# Altium schematic sheet Cell2_Balancing.SchDoc
size A; DocumentNumber: 5; SheetNumber: 5; SheetTotal: 7
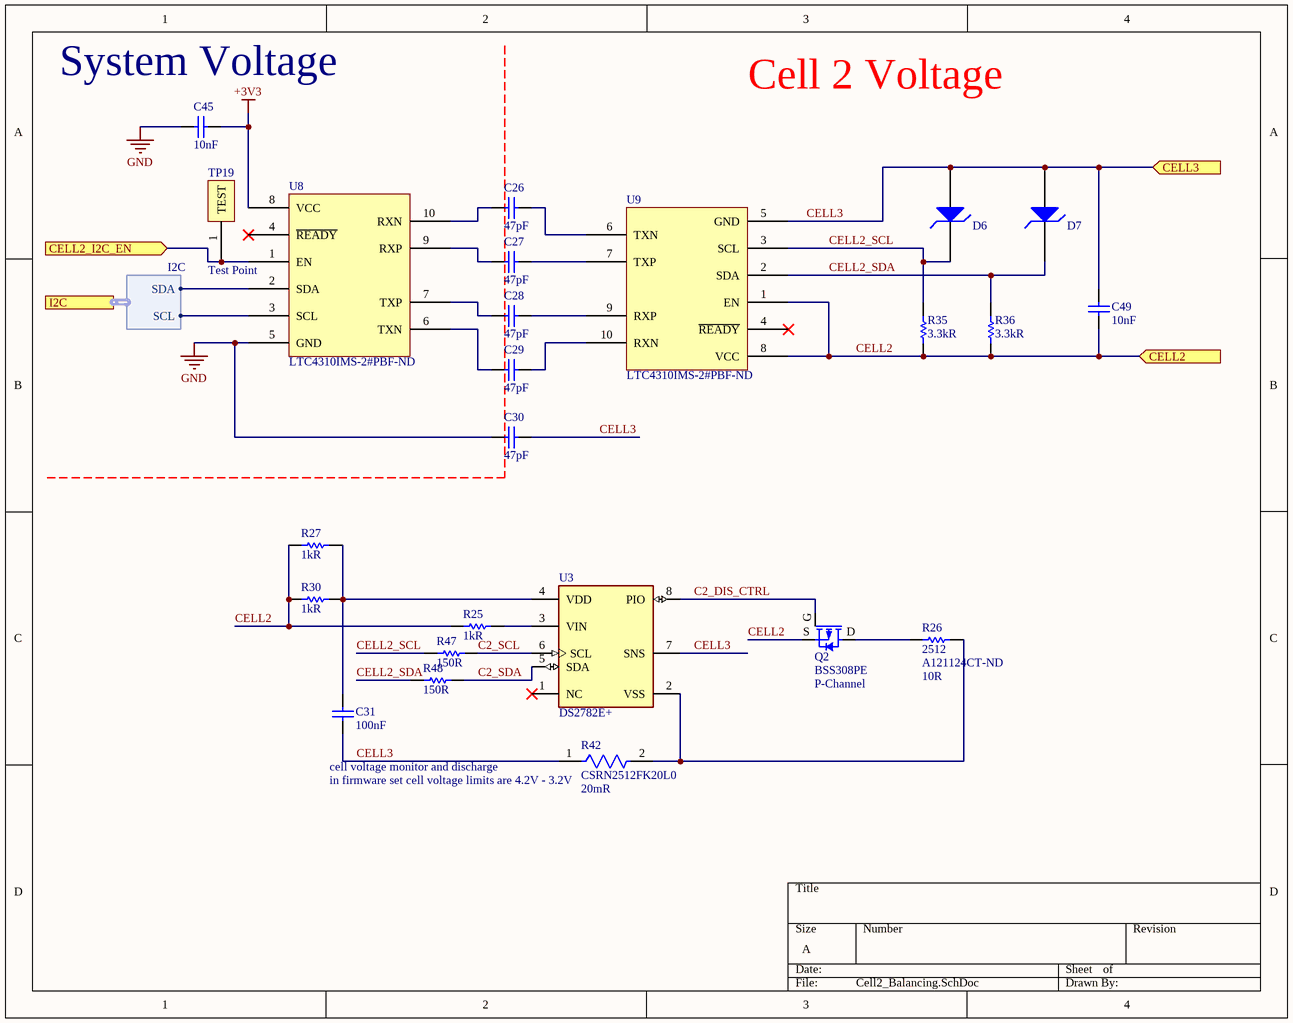
[diagram p0: Cell2_Balancing.SchDoc]

## Parts
C26  Capacitance: 47pF  [CAPC1608X90X35ML15T15]  (hidden comment: 06031A470FAT2A)
C27  Capacitance: 47pF  [CAPC1608X90X35ML15T15]  (hidden comment: 06031A470FAT2A)
C28  Capacitance: 47pF  [CAPC1608X90X35ML15T15]  (hidden comment: 06031A470FAT2A)
C29  Capacitance: 47pF  [CAPC1608X90X35ML15T15]  (hidden comment: 06031A470FAT2A)
C30  Capacitance: 47pF  [CAPC1608X90X35ML15T15]  (hidden comment: 06031A470FAT2A)
C31  Capacitance: 100nF  [C0402]  (hidden comment: Capacitor 0402)
C45  Capacitance: 10nF  [C0402]  (hidden comment: Capacitor 0402)
C49  Capacitance: 10nF  [C0402]  (hidden comment: Capacitor 0402)
D6  BZT52C4V7LP-7  [bzt52c4v7lp-7]  (value not drawn)
D7  BZT52C4V7LP-7  [bzt52c4v7lp-7]  (value not drawn)
Q2  BSS308PE  FET Type: P-Channel  [BSS308PE]
R25  Resistance: 1kR  [RES0402]  (hidden comment: Resistor 0402)
R26  Package / Case: 2512  Supplier Part Number 1: A121124CT-ND  Resistance: 10R  [RES2512]  (hidden comment: Resistor 2512)
R27  Resistance: 1kR  [RES0402]  (hidden comment: Resistor 0402)
R30  Resistance: 1kR  [RES0402]  (hidden comment: Resistor 0402)
R35  Resistance: 3.3kR  [RES0402]  (hidden comment: Resistor 0402)
R36  Resistance: 3.3kR  [RES0402]  (hidden comment: Resistor 0402)
R42  CSRN2512FK20L0  Resistance: 20mR  [FP-CSRN2512-IPC_C]
R47  Resistance: 150R  [RES0402]  (hidden comment: Resistor 0402)
R48  Resistance: 150R  [RES0402]  (hidden comment: Resistor 0402)
TP19  Test Point  [TEST POINT]
U3  DS2782E+  [FP-H8-2-MFG]
U8  LTC4310IMS-2#PBF-ND  [MSOP-10_MS_LIT]
U9  LTC4310IMS-2#PBF-ND  [MSOP-10_MS_LIT]

## Ports
CELL2 (in), CELL2_I2C_EN (in), CELL3 (in), I2C (harness I2C)

## Harnesses
I2C: SCL, SDA

## Nets
+3V3: C45.1 U8.8(VCC)
GND: C30.1 C45.2 U8.5(GND)
C2_DIS_CTRL: Q2.G U3.8(PIO)
C2_SCL: R47.1 U3.6(SCL)
C2_SDA: R48.1 U3.5(SDA)
CELL2: C49.2 Q2.S R25.1 R27.1 R30.1 R35.1 R36.1 U9.1(EN) U9.8(VCC) ; port CELL2
CELL2_I2C_EN: TP19.1(TEST) U8.1(EN) ; port CELL2_I2C_EN
CELL2_SCL: D6.1(K) R35.2 R47.2 U9.3(SCL)
CELL2_SDA: D7.1(K) R36.2 R48.2 U9.2(SDA)
CELL3: C30.2 C31.1 C49.1 D6.2(A) D7.2(A) R42.1 U3.7(SNS) U9.5(GND) ; port CELL3
NetC26_1: C26.1 U8.10(RXN)
NetC26_2: C26.2 U9.6(TXN)
NetC27_1: C27.1 U8.9(RXP)
NetC27_2: C27.2 U9.7(TXP)
NetC28_1: C28.1 U8.7(TXP)
NetC28_2: C28.2 U9.9(RXP)
NetC29_1: C29.1 U8.6(TXN)
NetC29_2: C29.2 U9.10(RXN)
NetC31_2: C31.2 R27.2 R30.2 U3.4(VDD)
NetQ2_D: Q2.D R26.1
NetR25_2: R25.2 U3.3(VIN)
NetR26_2: R26.2 R42.2 U3.2(VSS)
NetU8_2: U8.2(SDA) ; port I2C.SDA
NetU8_3: U8.3(SCL) ; port I2C.SCL

Not connected (* = marked no-connect by the designer): U3 1(NC)*; U8 4(~{READY})*; U9 4(~{READY})*

## Notes on the sheet
- (near C45) System Voltage
- Cell 2 Voltage
- cell voltage monitor and discharge
- (near R42) in firmware set cell voltage limits are 4.2V - 3.2V

## Library data of the parts
C26-C30 = CMP-2006-04042-1: Manufacturer: AVX Interconnect / Elco; Voltage Rating: 100V; Part Number: 06031A470FAT2A
C31 = Capacitor 0402: CAP CER 0.1UF 25V X5R 0402 / High Value Multilayer Ceramic Capacitors (High dielectric type); Manufacturer: Taiyo Yuden; Manufacturer Part Number: TMK105BJ104KV-F; Tolerance: 10%; Package / Case: 0402; Supplier 1: Digi-Key; Supplier Part Number 1: 587-1456-1-ND; RoHS: Yes; Category: Ceramic Capacitors; Stock 1: 2308231; Pricing 1: 1=0.10000, 10=0.04200, 50=0.02280, 100=0.01860, 500=0.01328, 1000=0.01044, 2500=0.00949, 5000=0.00873 (USD); Mount: Surface Mount; Case/Package: 0402; Number of Pins: 2; Case Code (Imperial): 0402; Case Code (Metric): 1005; Weight: 2.3E-05oz; Min Operating Temperature: -55°C; Max Operating Temperature: 85°C; Packaging: Tape and Reel; Dielectric: X5R; Voltage Rating (DC): 25V; Voltage Rating: 25V; Package Quantity: 1; Termination: SMD/SMT; Resistor Type: Ceramic; Voltage: 25V; Series: M; Construction: Flat; Length: 1mm; Width: 0.5mm; Height: 0.5mm; Depth: 0.5mm; Thickness: 0.022inch; REACH SVHC: No SVHC; Lead Free: Lead Free; Halogen Free: Halogen Free; RoHS Compliant: Yes; ComponentLink1URL: https://datasheet.ciiva.com/131/tmk105bj104kv-f-ss-131420.pdf?src-supplier=Digi-Key; ComponentLink1Description: https://datasheet.ciiva.com/131/tmk105bj104kv-f-ss-131420.pdf?src-supplier=Digi-Key; ComponentLink2URL: https://datasheet.ciiva.com/15922/28tmk105bj104kv-f-15922315.pdf?src-supplier=Onlinecomponents.com; ComponentLink2Description: https://datasheet.ciiva.com/15922/28tmk105bj104kv-f-15922315.pdf?src-supplier=Onlinecomponents.com; ComponentLink3URL: https://datasheet.ciiva.com/30051/25tmk105bj104kv-f-30051094.pdf?src-supplier=Onlinecomponents.com; ComponentLink3Description: https://datasheet.ciiva.com/30051/25tmk105bj104kv-f-30051094.pdf?src-supplier=Onlinecomponents.com; ComponentLink4URL: https://datasheet.ciiva.com/22768/1693457-22768649.pdf?src-supplier=Farnell; ComponentLink4Description: https://datasheet.ciiva.com/22768/1693457-22768649.pdf?src-supplier=Farnell
C45 C49 = Capacitor 0402: Cap Ceramic 0.01uF 25V X7R 10% Pad SMD 0402 125C T/R; Manufacturer: Samsung; Manufacturer Part Number: CL05B103KA5NNNC; Package / Case: 0402; Supplier 1: Digi-Key; Supplier Part Number 1: 1276-1057-2-ND; RoHS: Yes; Category: Ceramic Capacitors; Stock 1: 889741; Pricing 1: 10000=0.00314, 20000=0.00299 (USD); Mount: Surface Mount; Case/Package: 0402; Case Code (Metric): 1005; Case Code (Imperial): 0402; Contact Plating: Tin; Min Operating Temperature: -55°C; Max Operating Temperature: 125°C; Tolerance: 10%; Dielectric: X7R; Packaging: Tape and Reel; Package Quantity: 1; Voltage Rating: 25V; Series: CL; Construction: Flat; Length: 1mm; Width: 0.02inch; Height: 0.5mm; Thickness: 0.022inch; Depth: 0.5mm; Radiation Hardening: No; RoHS Compliant: Yes; ComponentLink1URL: https://datasheet.ciiva.com/15195/getdatasheetpartid-358612-15195635.pdf?src-supplier=Verical; ComponentLink1Description: https://datasheet.ciiva.com/15195/getdatasheetpartid-358612-15195635.pdf?src-supplier=Verical; ComponentLink2URL: https://datasheet.ciiva.com/16740/cl05b104kq5nnnc-16740683.pdf?src-supplier=Future+Electronics; ComponentLink2Description: https://datasheet.ciiva.com/16740/cl05b104kq5nnnc-16740683.pdf?src-supplier=Future+Electronics
D6 D7 = BZT52C4V7LP-7: BZT52C4V7LP Series 4.7 V 10 mA Surface Mount Zener Diode - DFN1006-2; Manufacturer: Diodes; Max Power Dissipation: 250mW; Max Reverse Leakage Current: 3uA; Zener Voltage: 4.7V; Element Configuration: Single; Tolerance: 6%; Impedance: 80R; Voltage Tolerance: 6.38%; Test Current: 5mA; Forward Voltage: 900mV; ESD Protection: No; Supplier 1: Digi-Key; Supplier Part Number 1: BZT52C4V7LPDICT-ND; Manufacturer Part Number: BZT52C4V7LP-7; RoHS: Yes; Category: Zener Diodes; Stock 1: 13216; Pricing 1: 1=0.50000, 10=0.37000, 100=0.20930, 500=0.13860, 1000=0.10626 (USD); Mount: Surface Mount; Case/Package: DFN; Number of Pins: 2; Weight: 3.5E-05oz; Contact Plating: Gold; Min Operating Temperature: -65°C; Max Operating Temperature: 150°C; Packaging: Tape and Reel; Package Quantity: 3000; Power Dissipation: 250mW; Termination: SMD/SMT; Zener Current: 3uA; Max Reverse Current: 3uA; Power Rating: 250mW; Series: -; Length: 1mm; Width: 0.6mm; Height: 0.5mm; REACH SVHC: No SVHC; Lead Free: Lead Free; RoHS Compliant: Yes; ComponentLink1URL: https://datasheet.ciiva.com/4734/ds30506-89295-4734027.pdf?src-supplier=Mouser; ComponentLink1Description: https://datasheet.ciiva.com/4734/ds30506-89295-4734027.pdf?src-supplier=Mouser; ComponentLink2URL: https://datasheet.ciiva.com/10639/ds30506-10639820.pdf?src-supplier=Avnet; ComponentLink2Description: https://datasheet.ciiva.com/10639/ds30506-10639820.pdf?src-supplier=Avnet
Q2 = BSS308PE: MOSFET P-CH 30V 2A SOT23; Current - Continuous Drain (Id) @ 25°C: 2A (Ta); Drive Voltage (Max Rds On, Min Rds On): 4.5V, 10V; Vgs(th) (Max) @ Id: 2V @ 11µA; Gate Charge (Qg) (Max) @ Vgs: 5nC @ 10V; Input Capacitance (Ciss) (Max) @ Vds: 500pF @ 15V; Vgs (Max): ±20V; Power Dissipation (Max): 500mW (Ta); Rds On (Max) @ Id, Vgs: 80 mOhm @ 2A, 10V; Supplier 1: Digi-Key; Supplier Part Number 1: BSS308PEH6327XTSA1CT-ND; Technology: MOSFET; Drain to Source Voltage (Vdss): 30V; Operating Temperature: -55°C ~ 150°C (TJ); Supplier Device Package: PG-SOT23-3
R25 R27 R30 = Resistor 0402: Res Thick Film 0402 1K Ohm 1% 0.063W(1/16W) ±100ppm/C Pad SMD Automotive T/R; Manufacturer: Stackpole Electronics; Manufacturer Part Number: RMCF0402FT1K00; Power Rating: 63mW; Temperature Coefficient: 100ppm/°C; Package / Case: 0402; Supplier 1: Digi-Key; Supplier Part Number 1: RMCF0402FT1K00CT-ND; RoHS: Yes; Category: Chip SMD Resistors; Stock 1: 10972117; Pricing 1: 1=0.10000, 10=0.01500, 100=0.00610, 1000=0.00274, 2500=0.00238, 5000=0.00197 (USD); Mount: Surface Mount; Case/Package: 0402; Case Code (Metric): 1005; Case Code (Imperial): 0402; Contact Plating: Tin,Matte; Size Code: 0402; Min Operating Temperature: -55°C; Max Operating Temperature: 155°C; Tolerance: 1%; Packaging: Tape and Reel; Resistor Type: Thick Film; Number of Terminations: 2; Max Power Dissipation: 63mW; Features: Automotive AEC-Q200; Series: RMCF; Construction: Rectangular; Length: 1mm; Width: 0.02inch; Height: 0.016inch; Depth: 0.5mm; Radiation Hardening: No; Military Standard: Not; Lead Free: Lead Free; RoHS Compliant: Yes; ComponentLink1URL: https://datasheet.ciiva.com/24336/sei-rmcp-24336266.pdf?src-supplier=Onlinecomponents.com; ComponentLink1Description: https://datasheet.ciiva.com/24336/sei-rmcp-24336266.pdf?src-supplier=Onlinecomponents.com; ComponentLink2URL: https://datasheet.ciiva.com/15193/getdatasheetpartid-365385-15193418.pdf?src-supplier=Verical; ComponentLink2Description: https://datasheet.ciiva.com/15193/getdatasheetpartid-365385-15193418.pdf?src-supplier=Verical
R26 = Resistor 2512: CGS - TE CONNECTIVITY - 352210RJT - SMD Chip Resistor, 2512 [6432 Metric], 10 ohm, 3522 Series, 250 V, Thick Film, 3 W; Manufacturer: TE Connectivity CGS; Manufacturer Part Number: 1-2176230-4; Power Rating: 3W; Voltage Rating: 250V; Tolerance: 5%; Number of Resistors: 1; Temperature Coefficient: 200ppm/°C; Supplier 1: Digi-Key; RoHS: Yes; Category: Chip SMD Resistors; Stock 1: 3022; Pricing 1: 1=0.74000, 10=0.62000, 100=0.41620, 1000=0.24350 (USD); Mount: Surface Mount; Case/Package: 2512; Case Code (Metric): 6432; Case Code (Imperial): 2512; Min Operating Temperature: -55°C; Max Operating Temperature: 105°C; Termination: Solder; Packaging: Tape and Reel; Resistor Type: Thick Film,Power resistor; Voltage Rating (DC): 250V; Number of Terminations: 2; Length: 6.35mm; Height: 1.1mm; Depth: 3.2mm; RoHS Compliant: Yes; REACH SVHC: Unknown; ComponentLink1URL: http://www.farnell.com/datasheets/2007092.pdf?src-supplier=Farnell; ComponentLink1Description: http://www.farnell.com/datasheets/2007092.pdf?src-supplier=Farnell; ComponentLink2URL: http://uk.rs-online.com/webdocs/142d/0900766b8142d0f1.pdf?src-supplier=RSComponents; ComponentLink2Description: http://uk.rs-online.com/webdocs/142d/0900766b8142d0f1.pdf?src-supplier=RSComponents; ComponentLink3URL: http://www.te.com/commerce/DocumentDelivery/DDEController?Action=srchrtrv&DocNm=9-1773463-7&DocType=DS&DocLang=English&src-supplier=Digi-Key; ComponentLink3Description: http://www.te.com/commerce/DocumentDelivery/DDEController?Action=srchrtrv&DocNm=9-1773463-7&DocType=DS&DocLang=English&src-supplier=Digi-Key; ComponentLink4URL: https://www.te.com/commerce/DocumentDelivery/DDEController?Action=srchrtrv&DocNm=9-1773463-7&DocType=DS&DocLang=English&src-supplier=Digi-Key; ComponentLink4Description: https://www.te.com/commerce/DocumentDelivery/DDEController?Action=srchrtrv&DocNm=9-1773463-7&DocType=DS&DocLang=English&src-supplier=Digi-Key; ComponentLink5URL: http://www.farnell.com/datasheets/2007092.pdf?src-supplier=Element14; ComponentLink5Description: http://www.farnell.com/datasheets/2007092.pdf?src-supplier=Element14; ComponentLink6URL: http://www.farnell.com/datasheets/2007092.pdf?src-supplier=Newark; ComponentLink6Description: http://www.farnell.com/datasheets/2007092.pdf?src-supplier=Newark
R35 R36 = Resistor 0402: Res Thin Film 0402 3.3K Ohm 1% 1/16W ±50ppm/°C Molded SMD SMD Paper T/R; Manufacturer: Yageo; Manufacturer Part Number: RT0402FRE073K3L; Power Rating: 62.5mW; Voltage Rating: 50V; Max Power Dissipation: 63mW; Package / Case: 0402; Supplier 1: Digi-Key; Supplier Part Number 1: 13-RT0402FRE073K3LCT-ND; RoHS: Yes; Category: Chip SMD Resistors; Stock 1: 19890; Pricing 1: 1=0.10000, 10=0.07300, 100=0.02970, 1000=0.01336, 2500=0.01159, 5000=0.00958 (USD); Case/Package: 0402; Contact Plating: Tin,Matte; Case Code (Imperial): 0402; Case Code (Metric): 1005; Weight: 2.3E-05oz; Min Operating Temperature: -55°C; Max Operating Temperature: 125°C; Tolerance: 1%; Resistor Type: Thin Film; Temperature Coefficient: 50ppm/°C; Packaging: Tape and Reel; Termination: SMD/SMT; Voltage Rating (DC): 50V; Series: RT; Number of Terminations: 2; Construction: Rectangular; Length: 1mm; Width: 0.5mm; Height: 0.3mm; Depth: 0.5mm; Radiation Hardening: No; Military Standard: Not; Lead Free: Lead Free; RoHS Compliant: Yes; ComponentLink1URL: https://datasheet.ciiva.com/8893/pyu-rt-1-to-0-05-rohs-l-4-8893834.pdf?src-supplier=Avnet; ComponentLink1Description: https://datasheet.ciiva.com/8893/pyu-rt-1-to-0-05-rohs-l-4-8893834.pdf?src-supplier=Avnet; ComponentLink2URL: https://datasheet.ciiva.com/12810/pyu-rt-1-to-0-05-rohs-l-4-12810011.pdf?src-supplier=Mouser; ComponentLink2Description: https://datasheet.ciiva.com/12810/pyu-rt-1-to-0-05-rohs-l-4-12810011.pdf?src-supplier=Mouser
R42 = CMP-26527-002510-1: Res Thick Film 2512 20mΩ 1% 2W ±200ppm/°C Molded SMD Plastic T/R; Case/Package: 2512; Case Code (Metric): 6432; Length: 0.25inch; Temperature Coefficient: 200ppm/°C; Width: 0.124inch; Min Operating Temperature: -55°C; Packaging: Tape and Reel; Max Operating Temperature: 155°C; Height: 0.028inch; Number of Terminations: 2; Contact Plating: Tin; Max Power Dissipation: 2W; Case Code (Imperial): 2512; Resistor Type: Thick Film; Depth: 3.15mm; RoHS Compliant: Yes; Series: CSRN; Size Code: 2512; Military Standard: Not; Lead Free: Lead Free; Tolerance: 1%; Power Rating: 2W; Mount: Surface Mount; Radiation Hardening: No; Construction: Rectangular
R47 R48 = Resistor 0402: Res Thin Film 0402 150 Ohm 1% 1/16W ±50ppm/°C Molded SMD SMD Paper T/R; Manufacturer: Yageo; Manufacturer Part Number: RT0402FRE07150RL; Voltage Rating (DC): 50V; Max Power Dissipation: 63mW; Package / Case: 0402; Supplier 1: Digi-Key; Supplier Part Number 1: 13-RT0402FRE07150RLCT-ND; RoHS: Yes; Category: Chip SMD Resistors; Stock 1: 4336; Pricing 1: 1=0.10000, 10=0.07300, 100=0.02970, 1000=0.01336, 2500=0.01159, 5000=0.00958 (USD); Case/Package: 0402; Contact Plating: Tin,Matte; Min Operating Temperature: -55°C; Max Operating Temperature: 125°C; Tolerance: 1%; Resistor Type: Thin Film; Temperature Coefficient: 50ppm/°C; Packaging: Tape and Reel; Series: RT; Number of Terminations: 2; Construction: Rectangular; Length: 1mm; Width: 500um; Depth: 0.5mm; Radiation Hardening: No; Military Standard: Not; Lead Free: Lead Free; RoHS Compliant: Yes; ComponentLink1URL: http://components.arrow.com/part/dataview/0323_03313190?src-supplier=Arrow+Europe; ComponentLink1Description: http://components.arrow.com/part/dataview/0323_03313190?src-supplier=Arrow+Europe; ComponentLink2URL: http://www.yageo.com/documents/recent/PYu-RT_1-to-0.05_RoHS_L_6.pdf?src-supplier=Avnet; ComponentLink2Description: http://www.yageo.com/documents/recent/PYu-RT_1-to-0.05_RoHS_L_6.pdf?src-supplier=Avnet; ComponentLink3URL: http://www.yageo.com/documents/recent/PYu-RT_1-to-0.01_RoHS_L_10.pdf?src-supplier=Digi-Key; ComponentLink3Description: http://www.yageo.com/documents/recent/PYu-RT_1-to-0.01_RoHS_L_10.pdf?src-supplier=Digi-Key; ComponentLink4URL: http://www.yageo.com/documents/recent/PYu-RT_1-to-0.05_RoHS_L_(4).pdf?src-supplier=Avnet+Europe; ComponentLink4Description: http://www.yageo.com/documents/recent/PYu-RT_1-to-0.05_RoHS_L_(4).pdf?src-supplier=Avnet+Europe
U3 = CMP-05715-000007-1: IC FUEL GAUGE BATT 8TSSOP; Manufacturer: Maxim; Number Of Cells: 2; Standoff Height: 0.05mm; Nominal Supply Current: 65uA; Max Supply Voltage: 5.5V; Min Supply Voltage: 2.5V; Height: 1.1mm; Octopart: https://octopart.com/ds2782e%2B-maxim+integrated-8045252; Lead Free: Yes; Temperature: -40°C to +85°C; ComponentLink2Description: Datasheet; Temperature Range High: +85°C; Package: H8-2; RoHS: TRUE; ComponentLink2URL: https://datasheets.maximintegrated.com/en/ds/DS2782.pdf; Category: IC; Mouser Description: Battery Fuel Gauge, Li-ion/nimhl, TSSOP8; Device Class L1: Integrated Circuits (ICs); Manufacturer Part Number: DS2782E+; Automotive: No; Device Class L3: Battery Management; Temperature Range Low: -40°C; Digikey Description: IC FUEL GAUGE BATT 8TSSOP; Device Class L2: Power Management ICs; Footprint Url: https://pdfserv.maximintegrated.com/land_patterns/90-0248.PDF
U8 U9 = LTC4310IMS-2#PBF: DIGITAL ISOLATOR 2CH I2C 10MSOP